# EAGLE design circle (EAGLE 9.2.2)

## Sheet 1 of 2
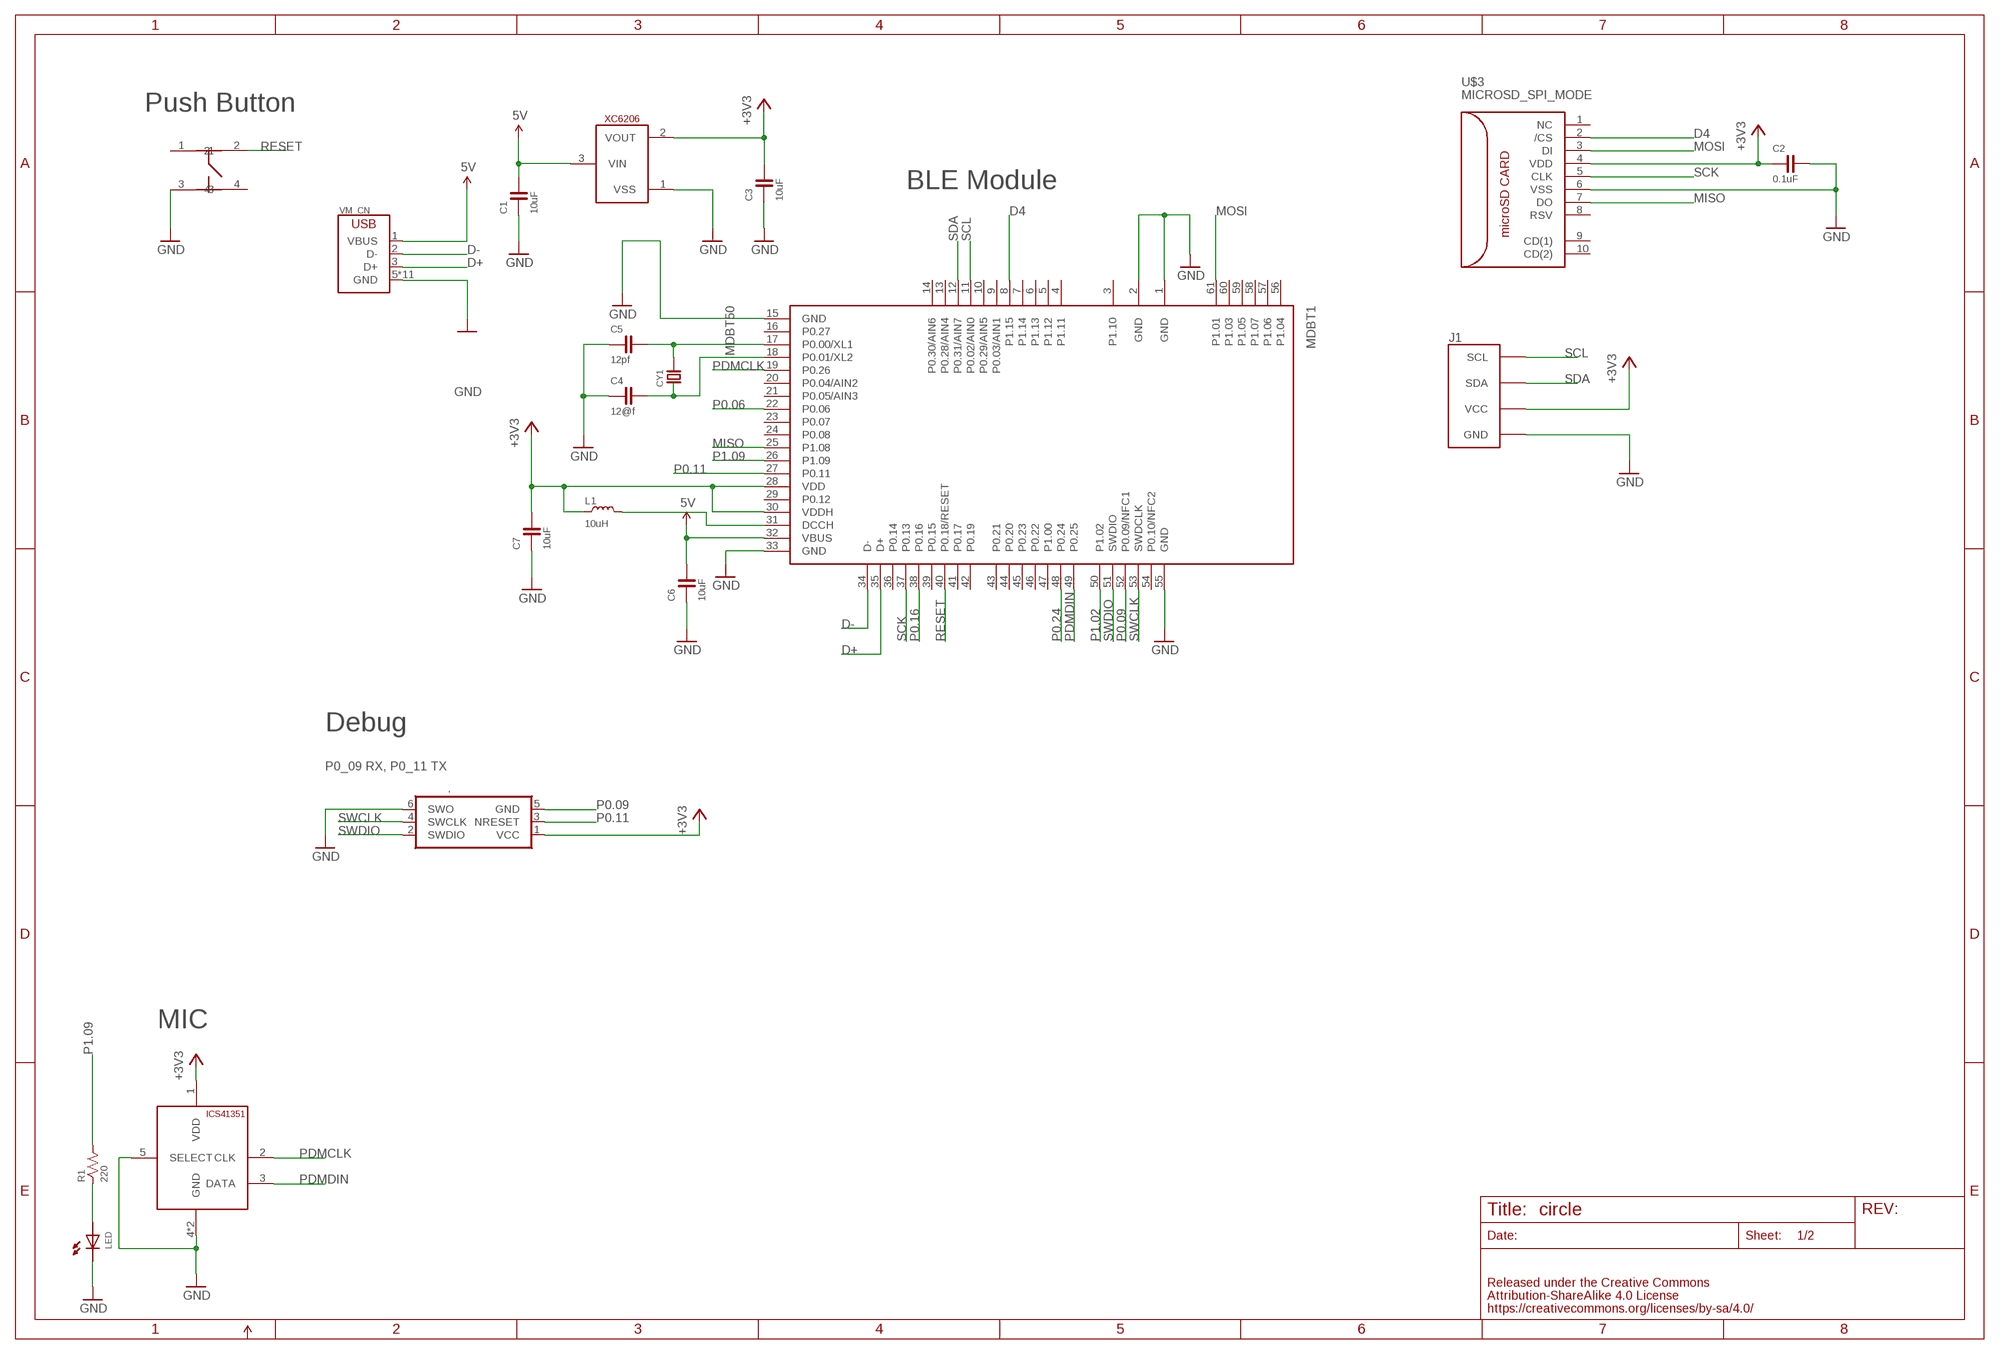
[diagram p0: schematic, sheet 1]

### Parts
.  TC2030-IDC-NL  [TC2030-IDC-NL]
C1  10uF  CAPACITOR-0603  [0603]
C2  0.1uF  CAPACITOR-0603  [0603]
C3  10uF  CAPACITOR-0603  [0603]
C4  12@f  CAPACITOR-0603  [0603]
C5  12pf  CAPACITOR-0603  [0603]
C6  10uF  CAPACITOR-0603  [0603]
C7  10uF  CAPACITOR-0603  [0603]
CY1  CRYSTAL-ABS07  [ABRACON-ABS07-32.768KHZ]
IC1  XC6206  [SOT-23]
J1  FABO_BRICK_I2C-B04B-PASK-1  [FABO_BRICK_I2C_B04B-PASK-1]
L1  10uH  COIL-0603  [0603]
LED  LED-0603  [0603]
MDBT1  MDBT50  [MDBT50]
MIC1  TDK-ICS41351  [ICS41351]
R1  220  RESISTOR-0603  [0603]
U$3  MICROSD_SPI_MODE  [MICRO_SD_CONNECTOR]
U$5  SWICTH-4P(KMR2)  [SWITCH-4P(KMR2)]
VM_CN  USB-ZX62D  [ZX62D-B-5PA8]

### Nets
5V: C1.2 C6.2 IC1.3(VIN) MDBT1.32(VBUS) VM_CN.1(VBUS)
+3V3: ..1(VCC) C2.1 C3.2 C7.2 IC1.2(VOUT) J1.VCC L1.1 MDBT1.28(VDD) MDBT1.30(VDDH) MIC1.1(VDD) U$3.4(VDD)
D4: MDBT1.8(P1.15) U$3.2(/CS)
D+: MDBT1.35(D+) VM_CN.3(D+)
D-: MDBT1.34(D-) VM_CN.2(D-)
GND: ..6(SWO) C1.1 C2.2 C3.1 C4.1 C5.1 C6.1 C7.1 IC1.1(VSS) J1.GND LED.CATHODE MDBT1.1(GND) MDBT1.2(GND) MDBT1.15(GND) MDBT1.33(GND) MDBT1.55(GND) MIC1.4(GND) MIC1.5(SELECT) MIC1.6(GND) U$3.6(VSS) U$5.3 VM_CN.5(GND) VM_CN.B1(GND) VM_CN.B2(GND) VM_CN.B3(GND) VM_CN.B4(GND) VM_CN.T1(GND) VM_CN.T2(GND) VM_CN.T3(GND) VM_CN.T4(GND) VM_CN.T5(GND) VM_CN.T6(GND) ; also sheet 2
MISO: MDBT1.25(P1.08) U$3.7(DO)
MOSI: MDBT1.61(P1.01) U$3.3(DI) ; also sheet 2
N$4: L1.2 MDBT1.31(DCCH)
N$5: LED.ANODE R1.1
N$7: C5.2 CY1.P$2 MDBT1.17(P0.00/XL1)
N$8: C4.2 CY1.P$1 MDBT1.18(P0.01/XL2)
P0.06: MDBT1.22(P0.06)
P0.09: ..5(GND) MDBT1.52(P0.09/NFC1)
P0.11: ..3(NRESET) MDBT1.27(P0.11)
P0.16: MDBT1.38(P0.16)
P0.24: MDBT1.48(P0.24)
P1.02: MDBT1.50(P1.02)
P1.09: MDBT1.26(P1.09) R1.2
PDMCLK: MDBT1.19(P0.26) MIC1.2(CLK)
PDMDIN: MDBT1.49(P0.25) MIC1.3(DATA)
RESET: MDBT1.40(P0.18/RESET) U$5.2
SCK: MDBT1.37(P0.13) U$3.5(CLK) ; also sheet 2
SCL: J1.SCL MDBT1.11(P0.02/AIN0)
SDA: J1.SDA MDBT1.12(P0.31/AIN7)
SWCLK: ..4(SWCLK) MDBT1.53(SWDCLK)
SWDIO: ..2(SWDIO) MDBT1.51(SWDIO)
Unconnected: MDBT1.3(P1.10) MDBT1.4(P1.11) MDBT1.5(P1.12) MDBT1.6(P1.13) MDBT1.7(P1.14) MDBT1.9(P0.03/AIN1) MDBT1.10(P0.29/AIN5) MDBT1.13(P0.28/AIN4) MDBT1.14(P0.30/AIN6) MDBT1.16(P0.27) MDBT1.20(P0.04/AIN2) MDBT1.21(P0.05/AIN3) MDBT1.23(P0.07) MDBT1.24(P0.08) MDBT1.29(P0.12) MDBT1.36(P0.14) MDBT1.39(P0.15) MDBT1.41(P0.17) MDBT1.42(P0.19) MDBT1.43(P0.21) MDBT1.44(P0.20) MDBT1.45(P0.23) MDBT1.46(P0.22) MDBT1.47(P1.00) MDBT1.54(P0.10/NFC2) MDBT1.56(P1.04) MDBT1.57(P1.06) MDBT1.58(P1.07) MDBT1.59(P1.05) MDBT1.60(P1.03) U$3.1(NC) U$3.8(RSV) U$3.9(CD(1)) U$3.10(CD(2)) U$5.1 U$5.4

### Notes on the sheet
- Push Button
- BLE Module
- Debug
- P0_09 RX, P0_11 TX
- MIC

## Sheet 2 of 2
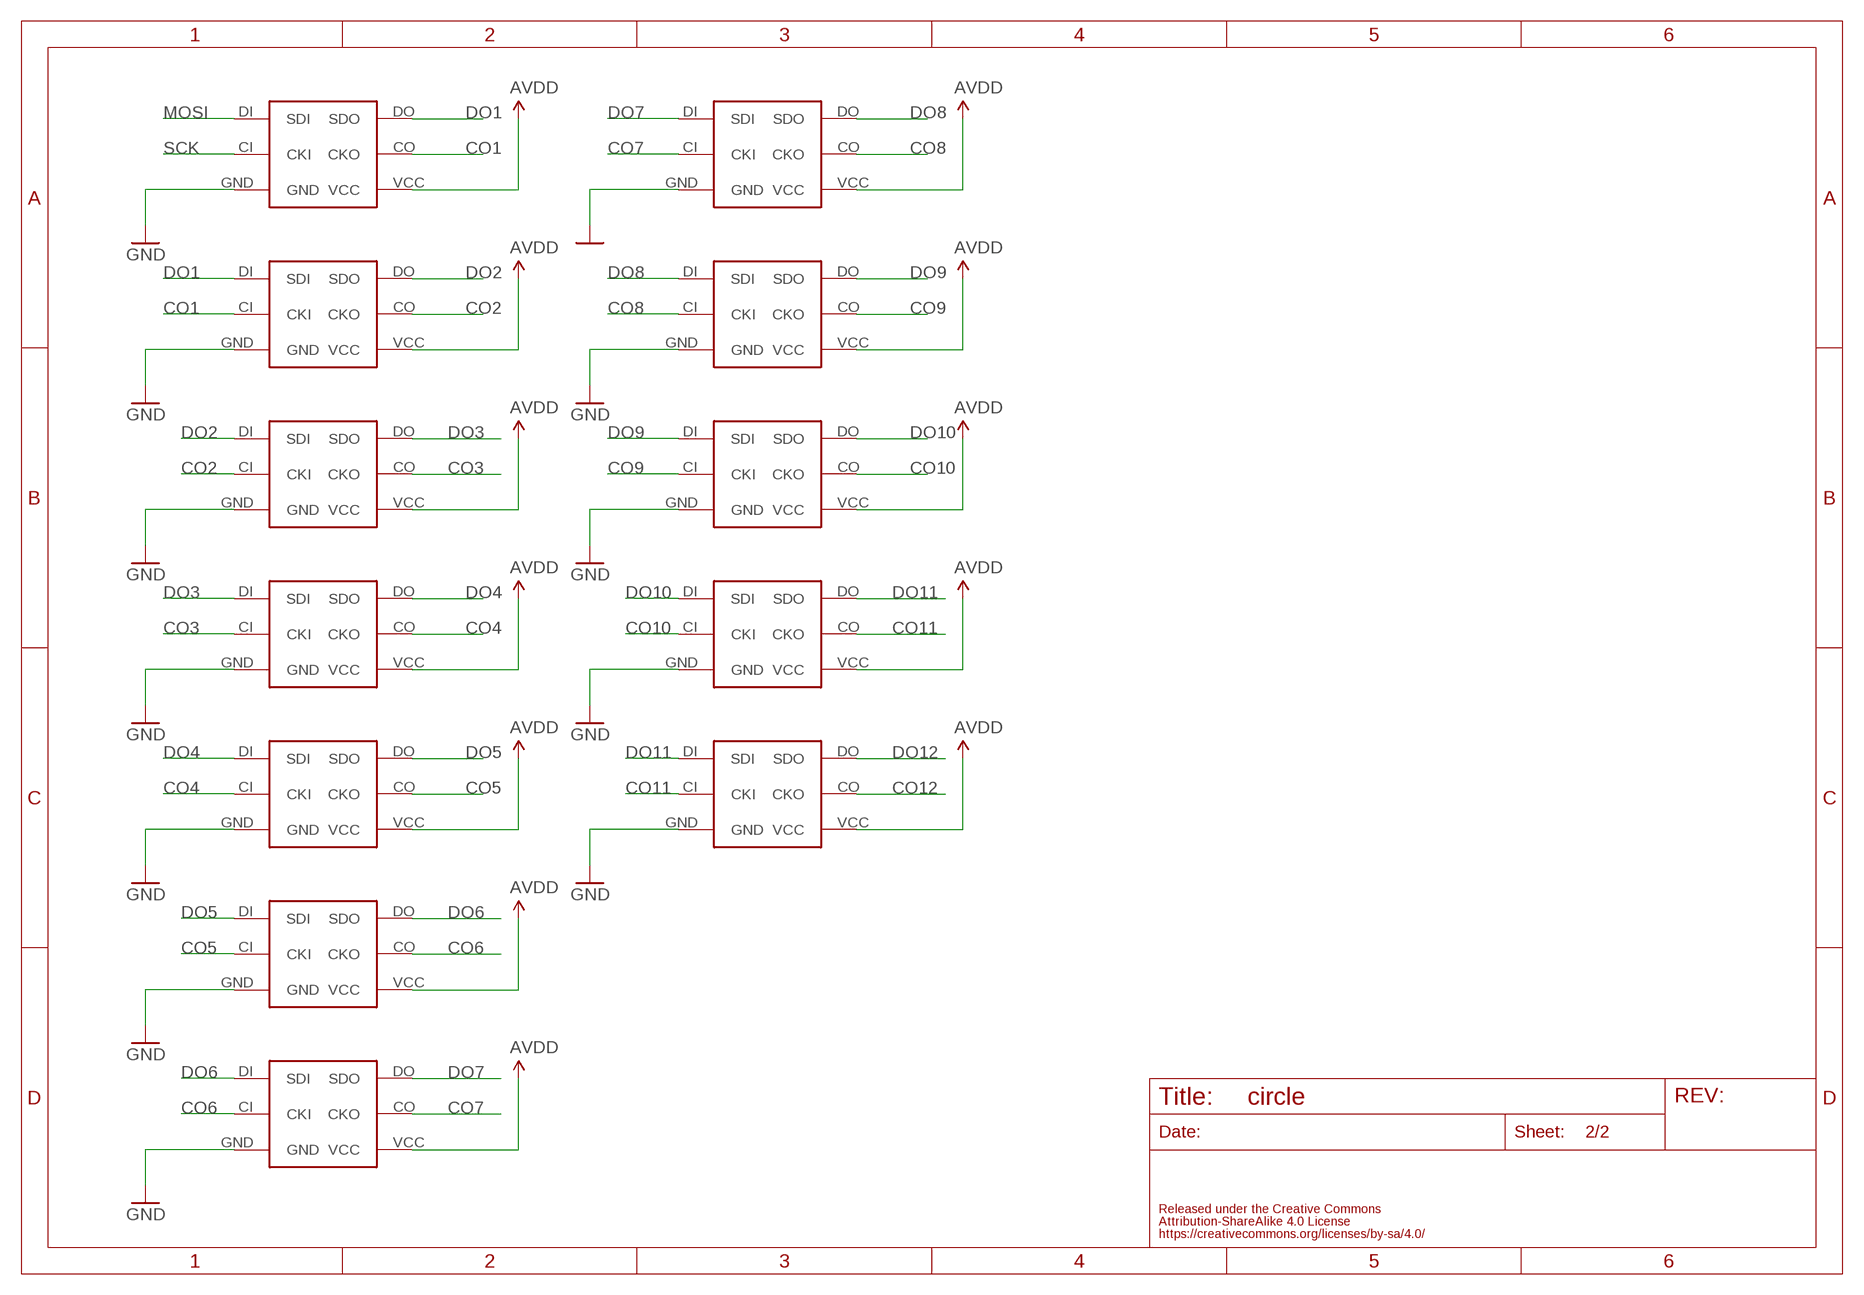
[diagram p1: schematic, sheet 2]

### Parts
0  APA102_IPIXEL  [APA102(IPIXEL)]
1  APA102_IPIXEL  [APA102(IPIXEL)]
2  APA102_IPIXEL  [APA102(IPIXEL)]
3  APA102_IPIXEL  [APA102(IPIXEL)]
4  APA102_IPIXEL  [APA102(IPIXEL)]
5  APA102_IPIXEL  [APA102(IPIXEL)]
6  APA102_IPIXEL  [APA102(IPIXEL)]
7  APA102_IPIXEL  [APA102(IPIXEL)]
8  APA102_IPIXEL  [APA102(IPIXEL)]
9  APA102_IPIXEL  [APA102(IPIXEL)]
10  APA102_IPIXEL  [APA102(IPIXEL)]
11  APA102_IPIXEL  [APA102(IPIXEL)]

### Nets
AVDD: 0.VCC 1.VCC 2.VCC 3.VCC 4.VCC 5.VCC 6.VCC 7.VCC 8.VCC 9.VCC 10.VCC 11.VCC
CO1: 0.CO(CKO) 1.CI(CKI)
CO2: 1.CO(CKO) 2.CI(CKI)
CO3: 2.CO(CKO) 3.CI(CKI)
CO4: 3.CO(CKO) 4.CI(CKI)
CO5: 4.CO(CKO) 5.CI(CKI)
CO6: 5.CO(CKO) 6.CI(CKI)
CO7: 6.CO(CKO) 7.CI(CKI)
CO8: 7.CO(CKO) 8.CI(CKI)
CO9: 8.CO(CKO) 9.CI(CKI)
CO10: 9.CO(CKO) 10.CI(CKI)
CO11: 10.CO(CKO) 11.CI(CKI)
CO12: 11.CO(CKO)
DO1: 0.DO(SDO) 1.DI(SDI)
DO2: 1.DO(SDO) 2.DI(SDI)
DO3: 2.DO(SDO) 3.DI(SDI)
DO4: 3.DO(SDO) 4.DI(SDI)
DO5: 4.DO(SDO) 5.DI(SDI)
DO6: 5.DO(SDO) 6.DI(SDI)
DO7: 6.DO(SDO) 7.DI(SDI)
DO8: 7.DO(SDO) 8.DI(SDI)
DO9: 8.DO(SDO) 9.DI(SDI)
DO10: 9.DO(SDO) 10.DI(SDI)
DO11: 10.DO(SDO) 11.DI(SDI)
DO12: 11.DO(SDO)
GND: 0.GND 1.GND 2.GND 3.GND 4.GND 5.GND 6.GND 7.GND 8.GND 9.GND 10.GND 11.GND ; also sheet 1
MOSI: 0.DI(SDI) ; also sheet 1
SCK: 0.CI(CKI) ; also sheet 1

## Library data of the parts
0 1-11 = FaBo-LED:APA102
. = TagConnect:TC2030-IDC: Tag-Connect In Circuit Programming & Debug Cable 6 Pin http://www.tag-connect.com
C1-C7 = FaBo-Capacitor:CAPACITOR: CAPACITOR
CY1 = FaBo-Crystal:CRYSTAL
IC1 = FaBo-VoltageRegulator:XC6206
J1 = FaBo-Template:FABO_BRICK_I2C: FaBo Brick I2C
L1 = FaBo-Coil:COIL: RESISTOR
LED = FaBo-LED:LED
MDBT1 = MDBT50Q_171031:MDBT50: Raytac Corporation MDBT50 Bluetooth Low Energy Module based on Noridc nRF52840 Source: Raytac datasheet
MIC1 = FaBo-Sound:TDK-ICS41351
R1 = FaBo-Resistors:RESISTOR: RESISTOR
U$3 = con-molex-microsd:MICROSD_SPI_MODE: MOLEX - 49225-0821 - CONNECTEUR MICRO SD PUSH/PUSH REV Fabricant: MOLEX Code commande Farnell: 1366700 <http://fr.farnell.com/molex/49225-0821/connecteur-micro-sd-push-push-rev/dp/1366700?Ntt=1366700> Référence fabricant: 49225-0821
U$5 = gclue-test:SWICTH-4P(KMR2)
VM_CN = component:USB

## Net classes
2 gnd: width 0.254 mm, drill 0.61 mm, clearance 0.254 mm
3 usbvcc: width 0.254 mm, drill 0.61 mm, clearance 0.254 mm
4 aref: width 0.254 mm, drill 0.61 mm, clearance 0.254 mm

## Board
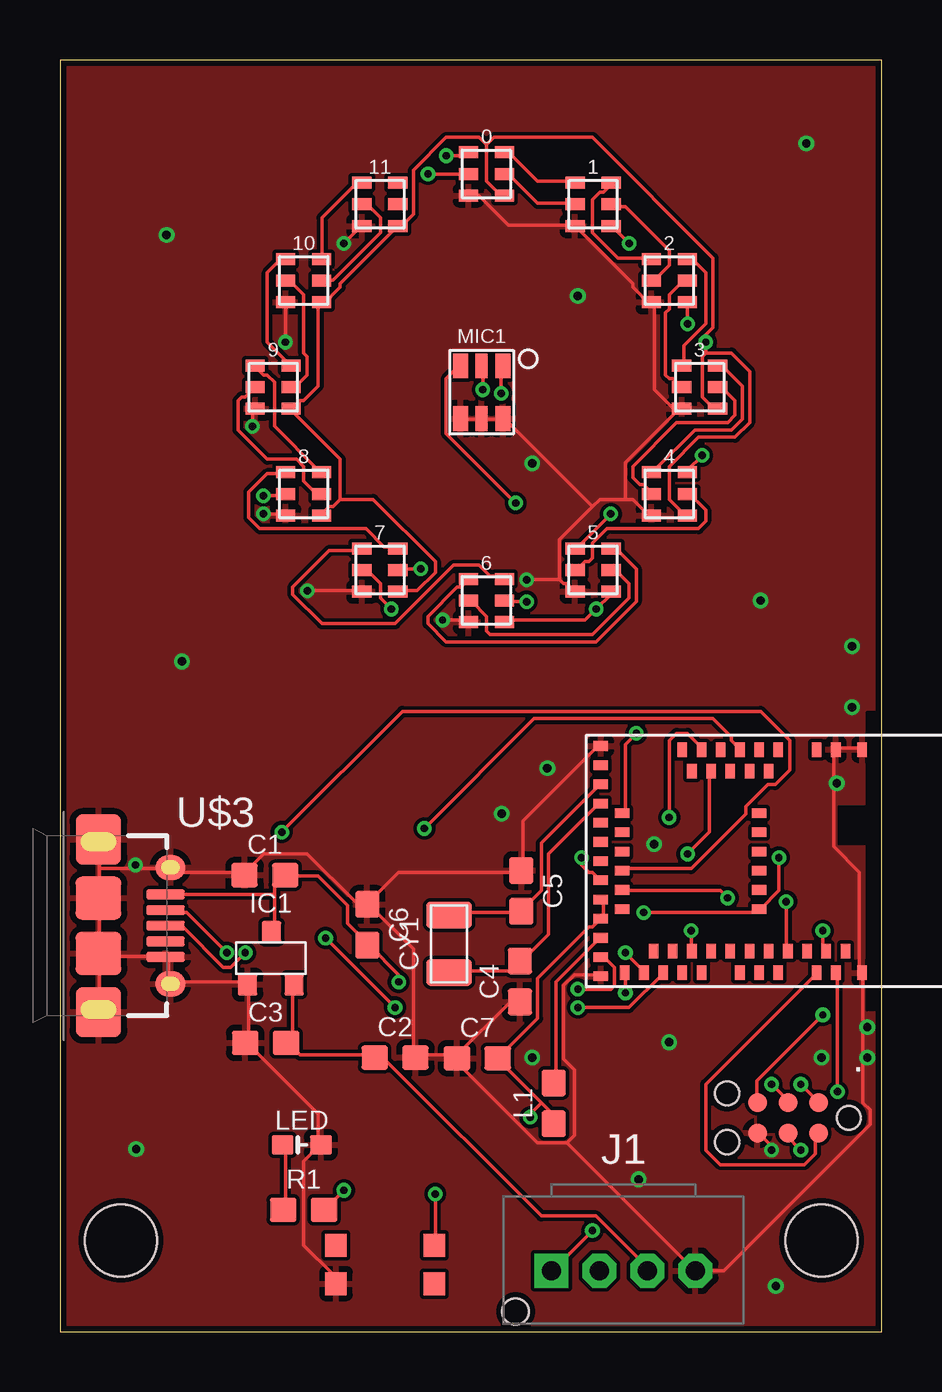
[diagram p2: board, top side]
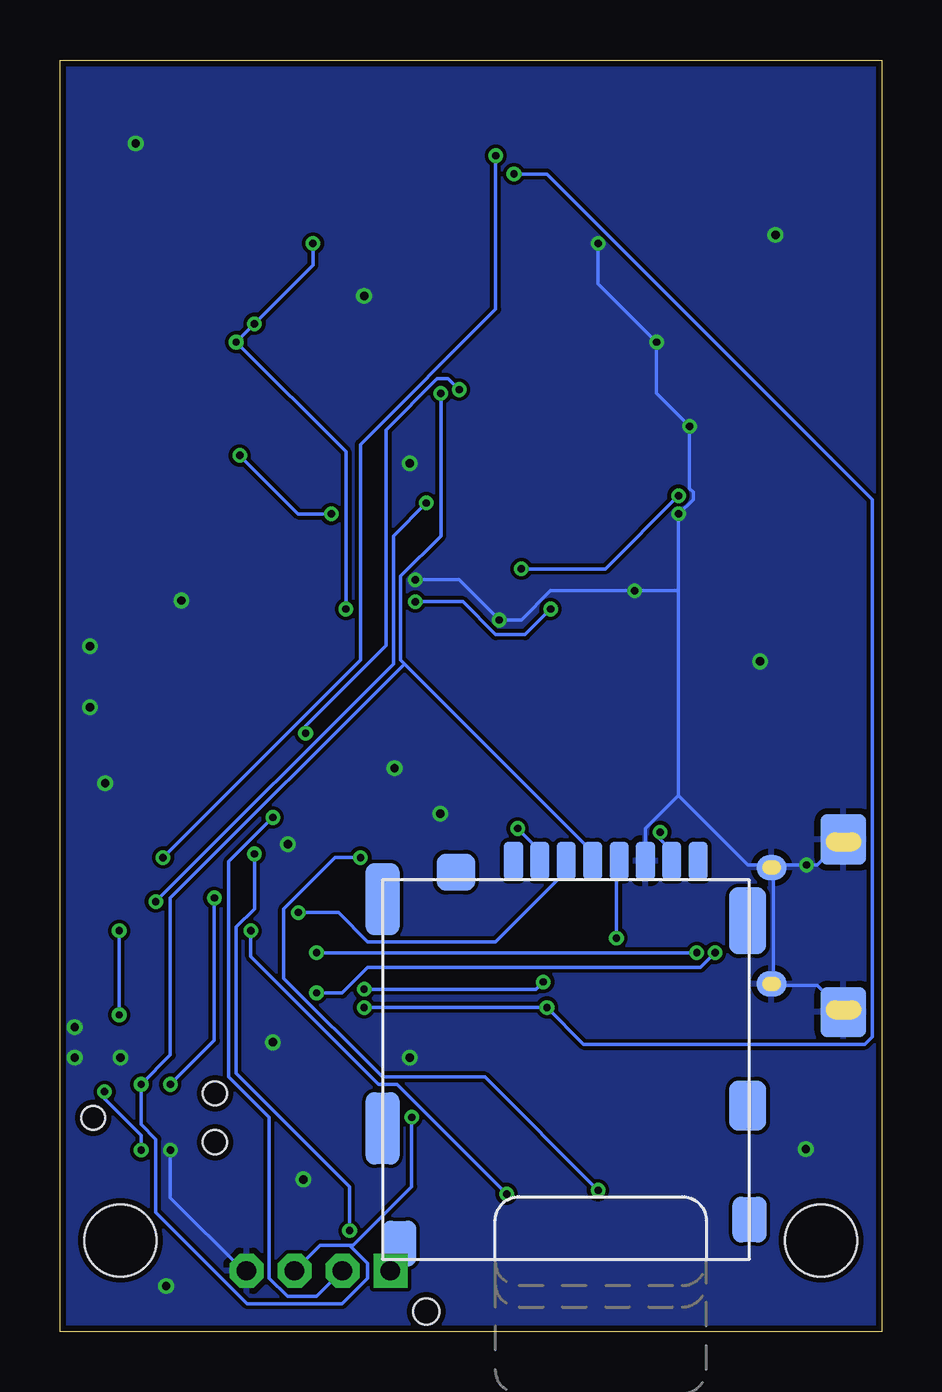
[diagram p3: board, bottom side, seen from below]

Size 34.27 x 53.01 mm. Coordinates in mm from the lower left corner, seen from the top.
Outline: 0,0 34.27,0 34.27,53.01 0,53.01 0,0
Copper layers (1*16): Top 0.035mm / dielectric 1.5mm / Bottom 0.035mm
Design rules "SeeedStudio_2layer_DRU_no_angle_20140221": minimum track width 6mil, minimum drill 12mil, track to track 6mil, track to pad 6mil, pad to pad 6mil, via to via 6mil, smd to smd 0mil, copper to edge 10mil, drill to drill 10mil, minimum pad ring 10mil, minimum via ring 6mil, stop-mask expansion 2mil, vias tented up to drill 100mil, thermal gap 10mil
Holes 3 mm at 2.54,3.81 31.75,3.81

### Footprints (pad centres in the part's own frame; a part is rotated, then mirrored left to right if it is on the bottom)
APA102(IPIXEL) = smd 0.8 x 0.5: CI -0.75,0; CO 0.75,0; DI -0.75,0.9; DO 0.75,0.9; GND -0.75,-0.9; VCC 0.75,-0.9
TC2030-IDC-NL = smd 0.787 x 0.787: 1 -1.27,-0.635; 2 -1.27,0.635; 3 0,-0.635; 4 0,0.635; 5 1.27,-0.635; 6 1.27,0.635 | hole 0.991: -2.54,0; 2.54,1.016; 2.54,-1.016
0603 = smd 1.1 x 1: 1 -0.85,0; 2 0.85,0
ABRACON-ABS07-32.768KHZ = smd 1.1 x 1.9: P$1 -1.2,0; P$2 1.2,0
SOT-23 = smd 0.8 x 0.9: 1 -0.97,-1.1; 2 0.97,-1.1; 3 0.03,1.1
FABO_BRICK_I2C_B04B-PASK-1 = drill 0.8 pad 1.422 octagon: GND -3,0; SDA 1,0; VCC -1,0 | drill 0.8 pad 1.422 square: SCL 3,0 | hole 1.1: 4.5,1.7
0603' = smd 0.9 x 0.8: ANODE -0.8,0; CATHODE 0.8,0
MDBT50 = smd 0.6 x 0.4: 1 -4.65,3.75; 2 -4.65,2.65; 3 -4.65,1.85; 4 -4.65,0.25; 5 -3.75,-0.15; 6 -4.65,-0.55; 7 -3.75,-0.95; 8 -4.65,-1.35; 9 -3.75,-1.75; 10 -4.65,-2.15; 11 -3.75,-2.55; 12 -4.65,-2.95; 13 -3.75,-3.35; 14 -4.65,-3.75; 34 4.65,-6.15; 35 4.65,-5.35; 36 3.75,-4.95; 37 4.65,-4.55; 38 3.75,-4.15; 39 4.65,-3.75; 40 3.75,-3.35; 41 4.65,-2.95; 42 3.75,-2.55; 43 3.75,-1.75; 44 4.65,-1.35; 45 3.75,-0.95; 46 4.65,-0.55; 47 3.75,-0.15; 48 4.65,0.25; 49 3.75,0.65; 50 3.75,1.45; 51 4.65,1.85; 52 3.75,2.25; 53 4.65,2.65; 54 3.75,3.05; 55 4.65,3.75 | smd 0.4 x 0.6: 15 -4.8,-7.15; 16 -4,-7.15; 17 -3.2,-7.15; 18 -2.4,-7.15; 19 -2,-6.25; 20 -1.6,-7.15; 21 -1.2,-6.25; 22 -0.8,-7.15; 23 -0.4,-6.25; 24 0,-7.15; 25 0.4,-6.25; 26 0.8,-7.15; 27 1.2,-6.25; 28 1.6,-7.15; 29 2,-6.25; 30 2.4,-7.15; 31 3.2,-7.15; 32 4,-7.15; 33 4.8,-7.15; 56 -2,-0.55; 57 -1.2,-0.55; 58 -0.4,-0.55; 59 0.4,-0.55; 60 1.2,-0.55; 61 2,-0.55
ICS41351 = smd 0.622 x 1.03: 1 0.884,1.1; 3 -0.884,1.1; 4 -0.884,-1.1; 6 0.884,-1.1 | smd 0.5 x 1.03: 2 0,1.1; 5 0,-1.1
MICRO_SD_CONNECTOR = smd 0.8 x 1.6 bottom: 1 2.03,8.2; 2 0.93,8.2; 3 -0.17,8.2; 4 -1.27,8.2; 5 -2.37,8.2; 6 -3.47,8.2; 7 -4.57,8.2; 8 -5.67,8.2 | smd 1.55 x 2.8 bottom: 9 -7.735,5.7 | smd 1.55 x 2.1 bottom: 10 -7.735,-2 | smd 1.4 x 1.9 bottom: 11 -7.81,-6.75; 12 6.79,-7.75 | smd 1.4 x 3 bottom: 13 7.49,-2.95; 14 7.49,6.6 | smd 1.6 x 1.55 bottom: 15 4.43,7.725
SWITCH-4P(KMR2) = smd 0.9 x 0.95: 1 -1,0; 2 3.1,0; 3 -1,-1.6; 4 3.1,-1.6
ZX62D-B-5PA8 = smd 0.4 x 1.6: 1 -1.3,4.25; 2 -0.65,4.25; 3 0,4.25; 4 0.65,4.25; 5 1.3,4.25 | smd 1.05 x 1.25 bottom: B1 -2.425,4.45; B2 2.425,4.45 | smd 2.1 x 1.9 bottom: B3 -3.6,1.45; B4 3.6,1.45 | smd 1.05 x 1.25: T1 -2.425,4.45; T2 2.425,4.45 | smd 2.1 x 1.9: T3 -3.6,1.45; T6 3.6,1.45 | smd 1.8 x 1.9: T4 -1.15,1.45; T5 1.15,1.45

### Placement (x,y rotation side)
0  17.78,48.26 0 top
1  22.23,46.99 0 top
2  25.4,43.81 0 top
3  26.67,39.37 0 top
4  25.4,34.92 0 top
5  22.23,31.75 0 top
6  17.78,30.48 0 top
7  13.34,31.75 0 top
8  10.16,34.92 0 top
9  8.89,39.37 0 top
10  10.16,43.81 0 top
11  13.34,46.99 0 top
.  30.35,8.92 180 top
C1  8.54,19.04 0 top
C2  13.97,11.43 0 top
C3  8.58,12.04 0 top
C4  19.18,14.6 90 top
C5  19.23,18.38 270 top
C6  12.81,16.96 270 top
C7  17.4,11.4 0 top
CY1  16.21,16.17 90 top
IC1  8.79,15.57 0 top
J1  23.5,2.54 180 top
L1  20.58,9.52 90 top
LED  [0603']  10.08,7.79 0 top
MDBT1  29.7,19.62 270 top
MIC1  17.58,39.16 0 top
R1  10.16,5.08 0 top
U$3  13.34,11.43 0 top
U$5  12.51,3.6 0 top
VM_CN  0.16,16.93 270 top

### Tracks (layer width: path | path; a pad name or v marks a point on that pad's centre or on a via)
5V  (via drill 0.3)
  Top 0.152: 8.94,18.24 8.94,18.69 9.25,19 C1.2 9.4,19 10.77,19 11.99,17.78 11.99,17.02 12.75,16.26 C6.2 12.9,16.1 14.12,14.88 v14.12,14.58 | 8.94,18.24 8.94,16.71 IC1.3 | 8.94,18.24 4.52,18.24 VM_CN.1 | v21.59,14.28 22.96,14.28 23.11,14.43 23.11,15.19 22.81,15.49 22.66,15.49 MDBT1.32
  Bottom 0.152: v21.59,14.28 14.43,14.28 v14.12,14.58
+3V3  (via drill 0.3)
  Top 0.152: v18.39,39.12 18.39,40.18 MIC1.1 | MDBT1.28 22.66,17.93 22.66,17.32 MDBT1.30 22.5,17.17 22.2,16.87 22.05,16.87 19.91,14.73 19.91,13.06 18.39,11.53 C7.2 18.24,11.38 20.07,9.55 | 20.07,9.55 20.52,9.09 20.52,8.79 L1.1 | IC1.2 9.7,14.43 9.7,12.29 9.55,12.14 C3.2 9.55,11.99 10.01,11.53 13.06,11.53 C2.1 13.21,11.38 13.51,11.38 20.07,4.83 22.35,4.83 24.64,2.54 J1.VCC | v30.89,10.31 31.5,9.7 ..1 | 20.07,9.55 19.61,9.09 v19.61,8.94
  Bottom 0.152: v18.39,39.12 18.39,33.17 20.07,31.5 20.07,27.99 19.91,27.84 | 19.91,27.84 12.14,20.07 12.14,19.76 U$3.4 | 22.2,3.61 21.44,2.85 21.44,2.23 22.5,1.17 26.47,1.17 30.28,4.98 30.28,8.03 30.89,8.64 v30.89,10.31 29.67,11.53 29.67,18.09 19.91,27.84 | 22.2,3.61 23.42,3.61 24.49,2.54 J1.VCC | v19.61,8.94 19.61,6.04 22.05,3.61 22.2,3.61
AVDD  (via drill 0.3)
  Top 0.152: 6.VCC 18.54,29.67 21.89,29.67 v22.35,30.12 22.96,30.73 5.VCC | 26.92,40.79 27.99,40.79 28.75,40.03 28.75,37.9 28.14,37.29 26.62,37.29 25.4,36.07 25.4,34.7 26.01,34.09 4.VCC | 26.92,40.79 26.77,40.64 26.77,38.96 27.38,38.35 3.VCC | v26.16,42.01 26.16,42.77 2.VCC | 26.92,40.79 v26.92,41.25 26.92,41.55 27.23,41.86 27.23,44.75 22.2,49.78 18.09,49.78 17.78,49.48 | v23.72,45.36 23.11,45.97 1.VCC | 11.68,34.7 11.38,34.39 11.23,34.39 10.92,34.09 8.VCC | 11.68,34.7 11.68,36.37 9.7,38.35 9.VCC 9.7,38.51 10.01,38.81 10.16,38.81 10.77,39.42 10.77,42.77 10.VCC 10.92,42.77 11.68,43.54 11.68,43.69 13.97,45.97 11.VCC 14.12,45.97 14.73,46.58 14.73,48.41 16.1,49.78 17.48,49.78 17.78,49.48 | 11.68,34.7 13.06,34.7 15.65,32.11 15.65,31.65 14.88,30.89 14.12,30.89 7.VCC | 17.78,49.48 17.78,47.95 18.24,47.5 18.39,47.5 0.VCC
  Bottom 0.152: v23.72,45.36 23.72,44.45 v26.16,42.01 v26.92,41.25 22.35,36.68 v22.35,30.12
CO1
  Top 0.152: 0.CO 18.69,48.26 19.91,47.04 21.44,47.04 1.CI
CO2
  Top 0.152: 1.CO 23.11,46.89 23.57,46.89 25.4,45.06 25.4,44.45 24.79,43.84 2.CI
CO3
  Top 0.152: 3.CI 25.86,39.42 25.55,39.73 25.4,39.73 25.25,39.88 25.25,42.47 25.4,42.62 25.4,43.23 26.01,43.84 2.CO
CO4
  Top 0.152: 4.CI 24.64,35 24.33,35.31 24.18,35.31 23.88,35.61 23.88,36.07 25.71,37.9 27.84,37.9 28.14,38.2 28.14,38.81 27.53,39.42 3.CO
CO5
  Top 0.152: 5.CI 21.59,31.8 21.89,32.11 22.05,32.11 22.2,32.26 22.2,32.87 22.81,33.48 26.62,33.48 26.92,33.78 26.92,34.24 26.16,35 4.CO
CO6
  Top 0.152: 6.CI 17.17,30.43 17.78,29.82 17.78,29.21 17.93,29.06 22.2,29.06 23.72,30.58 23.72,31.19 23.11,31.8 5.CO
CO7  (via drill 0.3)
  Top 0.152: v19.46,30.43 18.54,30.43 6.CO | v13.82,30.12 13.36,30.58 13.36,31.19 12.9,31.65 12.6,31.65 7.CI
  Bottom 0.152: v19.46,30.43 17.48,30.43 16.1,29.06 14.88,29.06 v13.82,30.12
CO8  (via drill 0.3)
  Top 0.152: v15.04,31.8 14.12,31.8 7.CO | v8.48,34.85 9.4,34.85 8.CI
  Bottom 0.152: v15.04,31.8 11.53,31.8 v8.48,34.85
CO9
  Top 0.152: 9.CI 8.03,39.27 7.72,38.96 7.57,38.96 7.42,38.81 7.42,37.59 8.64,36.37 9.86,36.37 10.16,36.07 10.16,35.46 10.77,34.85 8.CO
CO10
  Top 0.152: 10.CI 9.55,43.69 9.7,43.69 10.16,43.23 10.16,40.79 10.31,40.64 10.31,39.88 9.7,39.27 9.CO
CO11
  Top 0.152: 10.CO 10.92,43.84 11.38,43.84 13.36,45.82 13.36,46.43 12.9,46.89 12.6,46.89 11.CI
D4  (via drill 0.3)
  Top 0.152: v15.19,20.98 19.76,25.55 27.23,25.55 27.99,24.79 27.99,24.64 28.3,24.33 MDBT1.8
  Bottom 0.152: v15.19,20.98 14.28,20.07 14.28,19.76 U$3.2
D+  (via drill 0.3)
  Top 0.152: v23.57,15.8 24.33,15.04 MDBT1.35 | v7.72,15.8 7.11,15.19 6.81,15.19 5.13,16.87 4.52,16.87 VM_CN.3
  Bottom 0.152: v7.72,15.8 v23.57,15.8
D-  (via drill 0.3)
  Top 0.152: v23.57,14.12 23.57,14.88 MDBT1.34 | v6.96,15.8 5.28,17.48 4.52,17.48 VM_CN.2
  Bottom 0.152: v23.57,14.12 22.5,14.12 21.44,15.19 7.57,15.19 v6.96,15.8
DO1
  Top 0.152: 1.DI 21.44,47.95 19.91,47.95 18.85,49.02 18.54,49.02 0.DO
DO2
  Top 0.152: 1.DO 22.96,47.8 22.66,47.5 22.5,47.5 22.2,47.19 22.2,45.82 23.27,44.75 24.64,44.75 2.DI
DO3
  Top 0.152: 3.DI 26.01,40.33 26.01,41.1 26.92,42.01 26.92,44.14 26.47,44.6 26.16,44.6 2.DO
DO4
  Top 0.152: 4.DI 24.79,35.92 26.47,37.59 27.99,37.59 28.45,38.05 28.45,39.42 27.53,40.33 3.DO
DO5  (via drill 0.3)
  Top 0.152: v22.96,34.09 21.59,32.71 5.DI | v26.77,36.52 26.16,35.92 4.DO
  Bottom 0.152: v22.96,34.09 24.33,34.09 v26.77,36.52
DO6
  Top 0.152: 6.DI 17.02,31.34 16.71,31.04 16.56,31.04 15.34,29.82 15.34,29.52 16.1,28.75 22.35,28.75 24.03,30.43 24.03,31.8 23.11,32.71 5.DO
DO7
  Top 0.152: 6.DO 18.39,31.5 17.93,31.5 17.48,31.95 16.41,31.95 13.97,29.52 10.92,29.52 9.7,30.73 9.7,31.04 11.23,32.56 12.45,32.56 7.DI
DO8
  Top 0.152: 7.DO 13.97,32.71 13.51,32.71 12.75,33.48 8.33,33.48 7.87,33.93 7.87,35 8.64,35.76 9.4,35.76 8.DI
DO9
  Top 0.152: 9.DI 8.18,40.18 8.48,39.88 8.64,39.88 8.94,39.57 8.94,37.74 10.77,35.92 8.DO
DO10
  Top 0.152: 10.DI 9.4,44.6 9.09,44.6 8.64,44.14 8.64,41.25 9.55,40.33 9.DO
DO11
  Top 0.152: 10.DO 10.92,44.75 10.92,46.43 12.45,47.95 11.DI
GND  (via drill 0.3, 0.35)
  Top 0.152: MDBT1.1 33.32,24.33 32.41,24.33 MDBT1.2 32.26,24.18 32.26,20.22 33.32,19.15 33.32,15.04 MDBT1.55 33.48,14.88 33.48,9.55 33.78,9.25 33.78,8.64 27.69,2.54 J1.GND 26.47,2.54 21.13,7.87 | v29.67,7.57 29.67,7.72 29.21,8.18 ..6 | U$5.3 11.38,2.08 11.38,2.39 10.16,3.61 10.16,7.11 10.77,7.72 LED.CATHODE 10.77,7.87 10.77,9.09 7.87,11.99 C3.1 7.87,12.14 7.87,14.43 IC1.1 7.72,14.58 4.67,14.58 VM_CN.B2 4.52,14.58 4.52,15.49 VM_CN.5 4.37,15.65 1.63,15.65 | 21.13,7.87 21.44,8.18 21.44,10.92 20.98,11.38 20.98,14.43 21.44,14.88 22.5,14.88 MDBT1.33 | 21.13,7.87 19.91,7.87 16.41,11.38 C7.1 | C7.1 16.41,11.53 14.88,11.53 C2.2 14.73,11.53 14.73,15.95 12.9,17.78 C6.1 | C4.1 19.15,13.67 18.69,13.67 16.56,11.53 C7.1 | 1.63,15.65 1.63,13.36 VM_CN.T6 | 1.63,15.65 VM_CN.T5 1.63,15.8 1.63,17.93 VM_CN.T4 1.63,18.09 1.63,19.3 | 1.63,19.3 1.63,20.52 VM_CN.T3 | MDBT1.15 22.5,24.33 22.35,24.33 19.3,21.29 19.3,19.3 C5.1 19.15,19.15 14.12,19.15 12.9,17.93 C6.1 | C6.1 12.75,17.93 12.29,17.93 10.31,19.91 8.48,19.91 7.72,19.15 C1.1 7.57,19.15 4.83,19.15 4.67,19.3 VM_CN.T1 4.52,19.3 3.15,19.3 | 3.15,19.3 1.63,19.3 | MIC1.4 16.71,38.05 17.48,38.05 MIC1.5 17.63,38.05 18.39,38.05 MIC1.6 18.54,38.05 22.2,34.39 | 20.83,31.34 20.98,31.19 21.13,31.19 21.44,30.89 5.GND | 20.83,31.34 20.83,33.02 22.2,34.39 | 22.2,34.39 22.5,34.7 23.57,34.7 | 23.57,34.7 23.88,34.7 24.64,33.93 4.GND | 25.71,38.35 25.86,38.35 3.GND 25.71,38.35 | 25.71,38.35 23.57,36.22 23.57,34.7 | 25.71,38.35 24.79,39.27 24.79,42.77 2.GND 24.64,42.77 23.88,43.54 23.88,43.69 21.59,45.97 1.GND 21.44,46.13 18.69,46.13 17.48,47.35 17.17,47.35 0.GND
  Top 0.152: v8.48,34.09 9.4,34.09 8.GND | v10.31,30.89 12.45,30.89 7.GND | v8.03,37.74 8.03,38.35 9.GND | v15.95,29.67 17.02,29.67 6.GND | v9.4,41.25 9.4,42.77 10.GND | v11.84,45.36 12.45,45.97 11.GND | v19.46,31.34 20.83,31.34 | v3.15,19.46 3.15,19.3
  Bottom 0.152: v29.67,7.57 29.67,5.59 26.62,2.54 J1.GND | VM_CN.T6 1.63,13.36 2.69,14.43 4.52,14.43 VM_CN.B2 4.52,14.58 4.52,19.3 VM_CN.T1 | VM_CN.T1 4.52,19.46 v3.15,19.46 2.69,19.46 1.63,20.52 VM_CN.T3 | 8.48,22.35 8.48,30.89 | 8.48,30.89 v8.48,34.09 7.87,34.7 7.87,35 8.03,35.15 v8.03,37.74 9.4,39.12 v9.4,41.25 11.84,43.69 v11.84,45.36 | 8.48,22.35 9.86,20.98 9.86,19.76 U$3.6 | 8.48,30.89 v10.31,30.89 13.82,30.89 15.04,29.67 v15.95,29.67 17.63,31.34 v19.46,31.34 | 8.48,22.35 5.59,19.46 4.67,19.46 VM_CN.T1
  other vias: 5.08,27.94 4.45,45.72 21.59,43.18 31.11,49.53 29.21,30.48 18.41,21.59 3.18,7.62 29.84,1.9 24.13,6.35 25.4,12.07 19.68,36.2 24.77,20.32 31.75,11.43 19.68,11.43 20.32,23.5 32.38,22.86 33.02,26.04 33.02,28.57 33.65,11.43 33.65,12.7
  pour Top: -1.27,-1.27 35.56,-1.27 35.56,53.97 -1.27,53.97
  pour Bottom: -1.27,-1.27 35.56,-1.27 35.56,53.97 -1.27,53.97
MISO  (via drill 0.3)
  Top 0.152: v9.25,20.83 14.28,25.86 29.21,25.86 30.43,24.64 30.43,23.42 29.82,22.81 29.52,22.81 28.6,21.89 28.6,21.59 26.31,19.3 23.57,19.3 MDBT1.25
  Bottom 0.152: v9.25,20.83 9.25,20.52 8.79,20.07 8.79,19.76 U$3.7
MOSI  (via drill 0.3)
  Top 0.152: v24.33,17.48 29.06,17.48 MDBT1.61 29.21,17.63 29.97,18.39 v29.97,19.76 | v16.1,49.02 17.02,49.02 0.DI
  Bottom 0.152: v24.33,17.48 22.66,17.48 21.44,16.26 16.1,16.26 13.21,19.15 13.21,19.61 U$3.3 | v16.1,49.02 16.1,42.62 21.74,36.98 21.74,27.99 v29.97,19.76
N$4
  Top 0.152: MDBT1.31 22.5,16.41 20.68,14.58 20.68,10.46 L1.2
N$5
  Top 0.152: LED.ANODE 9.4,7.72 9.4,5.13 R1.1
N$7
  Top 0.152: MDBT1.17 22.5,22.81 20.07,20.37 20.07,18.39 19.3,17.63 C5.2 19.15,17.48 16.26,17.48 CY1.P$2
N$8
  Top 0.152: MDBT1.18 22.5,21.89 22.35,21.89 20.37,19.91 20.37,16.56 19.3,15.49 C4.2 19.15,15.34 18.85,15.04 16.26,15.04 CY1.P$1
P0.09  (via drill 0.3)
  Top 0.152: v31.8,16.71 31.8,15.95 MDBT1.52 | v31.8,13.21 29.06,10.46 29.06,9.7 ..5
  Bottom 0.152: v31.8,13.21 v31.8,16.71
P0.11  (via drill 0.3)
  Top 0.152: v27.84,18.09 27.53,18.39 23.57,18.39 MDBT1.27 | v29.67,10.31 30.28,9.7 ..3
  Bottom 0.152: v27.84,18.09 27.84,12.14 v29.67,10.31
P1.09  (via drill 0.3)
  Top 0.152: v21.74,19.76 21.74,19.46 22.05,19.15 22.2,19.15 22.5,18.85 MDBT1.26 | v11.84,5.89 11.07,5.13 R1.2
  Bottom 0.152: v21.74,19.76 22.81,19.76 24.94,17.63 24.94,14.73 20.83,10.62 16.56,10.62 v11.84,5.89
PDMCLK  (via drill 0.3)
  Top 0.152: v24.03,24.94 23.57,24.49 23.57,21.74 MDBT1.19 | v17.63,39.27 17.63,40.18 MIC1.2
  Bottom 0.152: v24.03,24.94 24.03,25.25 20.68,28.6 20.68,37.59 18.54,39.73 18.09,39.73 v17.63,39.27
PDMDIN  (via drill 0.3)
  Top 0.152: v30.28,17.93 30.28,15.95 MDBT1.49 | v19,34.54 16.1,37.44 16.1,39.73 16.56,40.18 MIC1.3
  Bottom 0.152: v30.28,17.93 20.37,27.84 20.37,33.17 v19,34.54
RESET  (via drill 0.3)
  Top 0.152: v26.31,16.71 26.31,15.95 MDBT1.40 | v15.65,5.74 15.65,3.61 U$5.2
  Bottom 0.152: v26.31,16.71 26.31,15.65 20.98,10.31 20.22,10.31 v15.65,5.74
SCK  (via drill 0.3)
  Top 0.152: v21.59,13.51 23.72,13.51 25.09,14.88 MDBT1.37 | v11.07,16.41 v13.97,13.51 | v15.34,48.26 0.CI
  Bottom 0.152: v21.59,13.51 v13.97,13.51 12.45,11.99 0.71,11.99 0.41,12.29 0.41,34.7 13.97,48.26 v15.34,48.26 | v11.07,16.41 11.07,19.61 U$3.5
SCL  (via drill 0.3)
  Top 0.152: v26.16,19.91 27.08,20.83 27.08,23.27 MDBT1.11 | v22.2,4.22 20.52,2.54 J1.SCL
  Bottom 0.152: v26.16,19.91 26.16,17.63 26.92,16.87 26.92,10.77 22.2,6.04 v22.2,4.22
SDA  (via drill 0.3)
  Top 0.152: v25.4,21.44 25.4,24.64 25.71,24.94 26.16,24.94 26.62,24.49 26.62,24.33 MDBT1.12
  Bottom 0.152: v25.4,21.44 27.23,19.61 27.23,10.62 25.55,8.94 25.55,2.23 24.79,1.47 23.57,1.47 J1.SDA
SWCLK  (via drill 0.3)
  Top 0.152: v32.41,10.01 32.41,14.88 MDBT1.53 | v30.89,7.57 30.28,8.18 ..4
  Bottom 0.152: v32.41,10.01 32.41,9.7 30.89,8.18 v30.89,7.57
SWDIO
  Top 0.152: MDBT1.51 31.5,14.88 26.92,10.31 26.92,7.57 27.53,6.96 31.04,6.96 31.5,7.42 31.5,8.18 ..2